# EAGLE design boards (EAGLE 9.4.2)

## Sheet 1 of 2
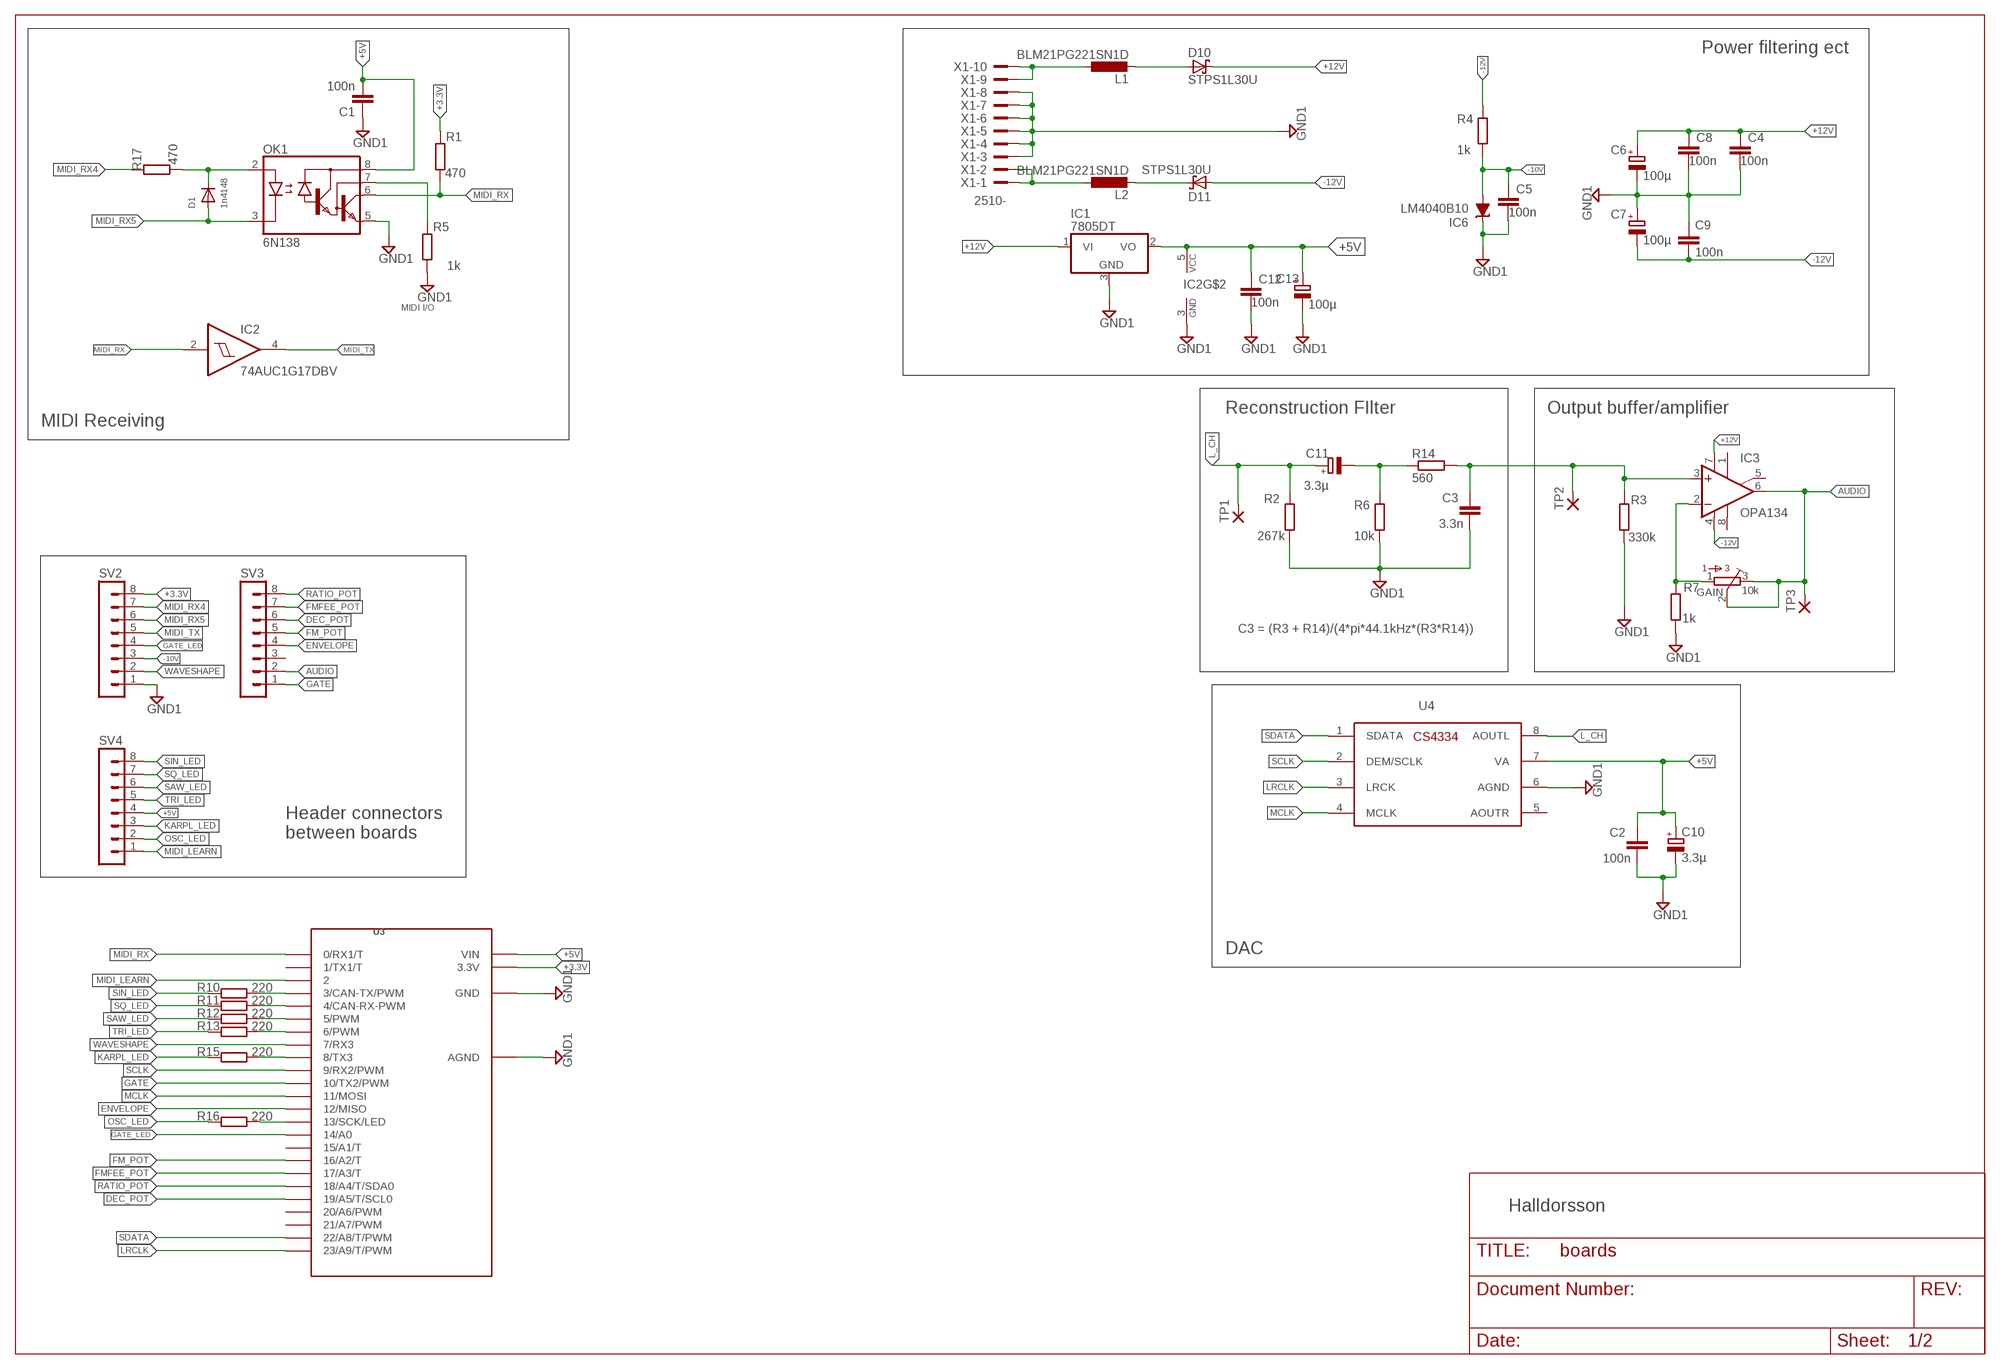
[diagram p0: schematic, sheet 1]

### Parts
C1  100n  C-EUC1206  [C1206]
C2  100n  C-EUC1206  [C1206]
C3  3.3n  C-EUC1206  [C1206]
C4  100n  C-EUC1206  [C1206]
C5  100n  C-EUC1206  [C1206]
C6  100µ  CPOL-EU153CLV-0505  [153CLV-0505]
C7  100µ  CPOL-EU153CLV-0505  [153CLV-0505]
C8  100n  C-EUC1206  [C1206]
C9  100n  C-EUC1206  [C1206]
C10  3.3µ  CPOL-EU153CLV-0405  [153CLV-0405]
C11  3.3µ  CPOL-EU153CLV-0405  [153CLV-0405]
C12  100n  C-EUC1206  [C1206]
C13  100µ  CPOL-EU153CLV-0505  [153CLV-0505]
D1  1n4148  DIODESOD-123  [SOD-123]
D10  STPS1L30U  MBRS130LT3  [SMB]
D11  STPS1L30U  MBRS130LT3  [SMB]
GAIN  10k  BOURNS_3362P_TRIMMERP  [BOURNS_3362P_TRIMMER]
IC1  7805DT  [TO252]
IC2  74AUC1G17DBV  [SOT23-5]
IC3  OPA134  TL071D  [SO08]
IC6  LM4040B10  LM4041B12DBZ  [DBZ_R-PDSO-G3]
L1  BLM21PG221SN1D  L-EUL2012C  [L2012C]
L2  BLM21PG221SN1D  L-EUL2012C  [L2012C]
OK1  6N138  [DIL08]
R1  470  R-EU_M1206  [M1206]
R2  267k  R-EU_M1206  [M1206]
R3  330k  R-EU_M1206  [M1206]
R4  1k  R-EU_M1206  [M1206]
R5  1k  R-EU_M1206  [M1206]
R6  10k  R-EU_M1206  [M1206]
R7  1k  R-EU_M1206  [M1206]
R10  220  R-EU_M1206  [M1206]
R11  220  R-EU_M1206  [M1206]
R12  220  R-EU_M1206  [M1206]
R13  220  R-EU_M1206  [M1206]
R14  560  R-EU_M1206  [M1206]
R15  220  R-EU_M1206  [M1206]
R16  220  R-EU_M1206  [M1206]
R17  470  R-EU_M1206  [M1206]
SV2  MA08-1  [MA08-1]
SV3  MA08-1  [MA08-1]
SV4  MA08-1  [MA08-1]
TP1  2,54/1,0  [2,54/1,0]
TP2  2,54/1,0  [2,54/1,0]
TP3  2,54/1,0  [2,54/1,0]
U3  TEENSY3.2.BAREBONES  [TEENSY3.2_BAREBONES]
U4  CS4334  [SOIC127P600X175-8N]
X1  2510-  [PAK100/2500-10]

### Nets
+3.3V: R1.2 SV2.8 U3.3.3V
+5V: C1.2 C2.1 C10.+ C12.1 C13.+ IC1.2(VO) IC2.5(VCC) OK1.8(VCC) SV4.4 U3.VIN U4.7(VA)
+12V: C4.1 C6.+ C8.1 D10.C IC1.1(VI) IC3.7(V+)
-10V: C5.1 IC6.2(A) R4.2 SV2.3
-12V: C7.- C9.2 D11.A IC3.4(V-) R4.1
AUDIO: GAIN.2 GAIN.3 IC3.6(OUT) SV3.2 TP3.1(P)
DEC_POT: SV3.6 U3.19/A5(19/A5/T/SCL0)
ENVELOPE: SV3.4 U3.12(12/MISO)
FM_POT: SV3.5 U3.16/A2(16/A2/T)
FMFEE_POT: SV3.7 U3.17/A3(17/A3/T)
GATE: SV3.1 U3.10(10/TX2/PWM)
GATE_LED: SV2.4 U3.14/A0
GND1: C1.1 C2.2 C3.2 C4.2 C5.2 C6.- C7.+ C8.2 C9.1 C10.- C12.2 C13.- IC1.3(GND) IC2.3(GND) IC6.1(C) OK1.5(GND) R2.2 R3.2 R5.1 R6.2 R7.2 SV2.1 U3.AGND U3.GND U4.6(AGND) X1.3 X1.4 X1.5 X1.6 X1.7 X1.8
KARPL_LED: R15.2 SV4.3
L_CH: C11.+ R2.1 TP1.1(P) U4.8(AOUTL)
LRCLK: U3.23/A9(23/A9/T/PWM) U4.3(LRCK)
MCLK: U3.11(11/MOSI) U4.4(MCLK)
MIDI_LEARN: SV4.1 U3.2
MIDI_RX: IC2.2(I) OK1.6(VO) R1.1 U3.0(0/RX1/T)
MIDI_RX4: R17.2 SV2.7
MIDI_RX5: D1.A OK1.3(C) SV2.6
MIDI_TX: IC2.4(O) SV2.5
N$1: C11.- R6.1 R14.1
N$4: D1.C OK1.2(A) R17.1
N$5: OK1.7(VB) R5.2
N$8: GAIN.1 IC3.2(-IN) R7.1
N$10: R16.1 U3.13(13/SCK/LED)
N$11: C3.1 IC3.3(+IN) R3.1 R14.2 TP2.1(P)
N$12: R10.1 U3.3(3/CAN-TX/PWM)
N$14: R11.1 U3.4(4/CAN-RX-PWM)
N$15: R12.1 U3.5(5/PWM)
N$19: R13.1 U3.6(6/PWM)
N$22: R15.1 U3.8(8/TX3)
N$46: L1.1 X1.9 X1.10
N$47: L2.1 X1.1 X1.2
N$49: D10.A L1.2
N$50: D11.C L2.2
OSC_LED: R16.2 SV4.2
RATIO_POT: SV3.8 U3.18/A4(18/A4/T/SDA0)
SAW_LED: R12.2 SV4.6
SCLK: U3.9(9/RX2/PWM) U4.2(DEM/SCLK)
SDATA: U3.22/A8(22/A8/T/PWM) U4.1(SDATA)
SIN_LED: R10.2 SV4.8
SQ_LED: R11.2 SV4.7
TRI_LED: R13.2 SV4.5
WAVESHAPE: SV2.2 U3.7(7/RX3)
Unconnected: IC3.1(ON1) IC3.5(ON2) IC3.8(OPT) SV3.3 U3.1(1/TX1/T) U3.15/A1(15/A1/T) U3.20/A6(20/A6/PWM) U3.21/A7(21/A7/PWM) U4.5(AOUTR)

### Notes on the sheet
- Power filtering ect
- MIDI I/O
- Reconstruction FIlter | Output buffer/amplifier
- MIDI Receiving
- C3 = (R3 + R14)/(4*pi*44.1kHz*(R3*R14))
- Header connectors 
  between boards
- DAC
- Halldorsson

## Sheet 2 of 2
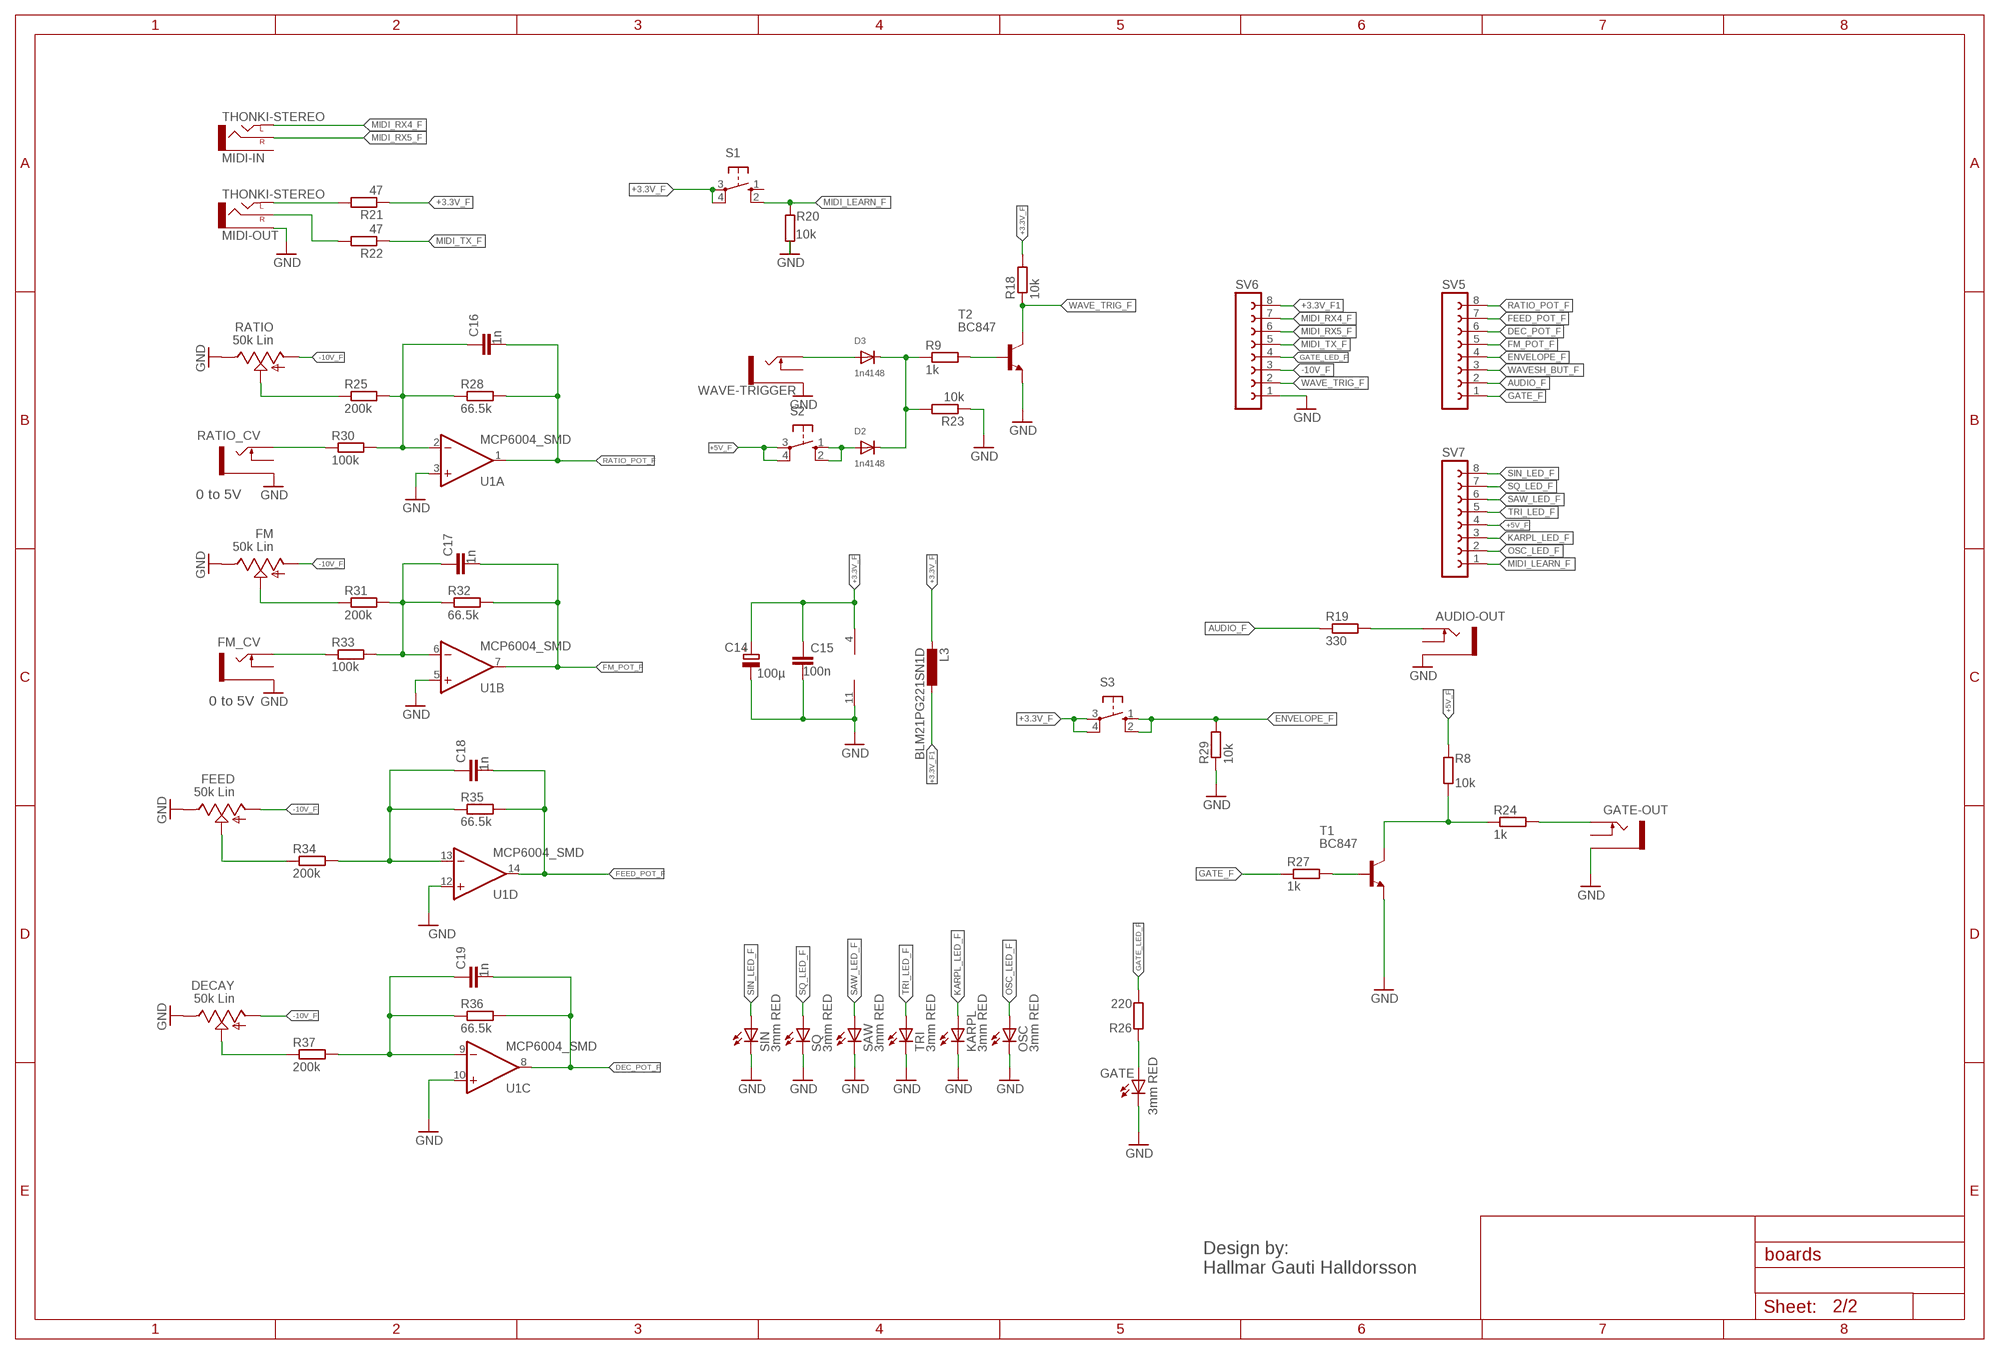
[diagram p1: schematic, sheet 2]

### Parts
AUDIO-OUT  THONKICONNNEW  [WQP-PJ301M-12_JACK]
C14  100µ  CPOL-EU153CLV-0505  [153CLV-0505]
C15  100n  C-EUC1206  [C1206]
C16  1n  C-EUC1206  [C1206]
C17  1n  C-EUC1206  [C1206]
C18  1n  C-EUC1206  [C1206]
C19  1n  C-EUC1206  [C1206]
D2  1n4148  DIODESOD-123  [SOD-123]
D3  1n4148  DIODESOD-123  [SOD-123]
DECAY  50k Lin  9MM_SNAP-IN_POT_  [9MM_SNAP-IN_POT]
FEED  50k Lin  9MM_SNAP-IN_POT_  [9MM_SNAP-IN_POT]
FM  50k Lin  9MM_SNAP-IN_POT_  [9MM_SNAP-IN_POT]
FM_CV  THONKICONNNEW  [WQP-PJ301M-12_JACK]
GATE  3mm RED  LED3MM  [LED3MM]
GATE-OUT  THONKICONNNEW  [WQP-PJ301M-12_JACK]
KARPL  3mm RED  LED3MM  [LED3MM]
L3  BLM21PG221SN1D  L-EUL2012C  [L2012C]
MIDI-IN  THONKI-STEREO  [WQP-PJ366ST_JACK]
MIDI-OUT  THONKI-STEREO  [WQP-PJ366ST_JACK]
OSC  3mm RED  LED3MM  [LED3MM]
R8  10k  R-EU_M1206  [M1206]
R9  1k  R-EU_M1206  [M1206]
R18  10k  R-EU_M1206  [M1206]
R19  330  R-EU_M1206  [M1206]
R20  10k  R-EU_M1206  [M1206]
R21  47  R-EU_M1206  [M1206]
R22  47  R-EU_M1206  [M1206]
R23  10k  R-EU_M1206  [M1206]
R24  1k  R-EU_M1206  [M1206]
R25  200k  R-EU_M1206  [M1206]
R26  220  R-EU_M1206  [M1206]
R27  1k  R-EU_M1206  [M1206]
R28  66.5k  R-EU_M1206  [M1206]
R29  10k  R-EU_M1206  [M1206]
R30  100k  R-EU_M1206  [M1206]
R31  200k  R-EU_M1206  [M1206]
R32  66.5k  R-EU_M1206  [M1206]
R33  100k  R-EU_M1206  [M1206]
R34  200k  R-EU_M1206  [M1206]
R35  66.5k  R-EU_M1206  [M1206]
R36  66.5k  R-EU_M1206  [M1206]
R37  200k  R-EU_M1206  [M1206]
RATIO  50k Lin  9MM_SNAP-IN_POT_  [9MM_SNAP-IN_POT]
RATIO_CV  THONKICONNNEW  [WQP-PJ301M-12_JACK]
S1  10-XX  [B3F-10XX]
S2  10-XX  [B3F-10XX]
S3  10-XX  [B3F-10XX]
SAW  3mm RED  LED3MM  [LED3MM]
SIN  3mm RED  LED3MM  [LED3MM]
SQ  3mm RED  LED3MM  [LED3MM]
SV5  FE08-1  [FE08]
SV6  FE08-1  [FE08]
SV7  FE08-1  [FE08]
T1  BC847  [SOT23]
T2  BC847  [SOT23]
TRI  3mm RED  LED3MM  [LED3MM]
U1  MCP6004_SMD  [SO14]
WAVE-TRIGGER  THONKICONNNEW  [WQP-PJ301M-12_JACK]

### Nets
+3.3V_F: C14.+ C15.1 L3.2 R18.2 R21.1 S1.3(P) S1.4(P1) S3.3(P) S3.4(P1) U1.4(P:V+)
+3.3V_F1: L3.1 SV6.8
+5V_F: R8.1 S2.3(P) S2.4(P1) SV7.4
-10V_F: DECAY.1(A) FEED.1(A) FM.1(A) RATIO.1(A) SV6.3
AUDIO_F: R19.1 SV5.2
B: R27.2 T1.1(B)
DEC_POT_F: C19.2 R36.2 SV5.6 U1.8(C:OUT)
ENVELOPE_F: R29.2 S3.1(S) S3.2(S1) SV5.4
FEED_POT_F: C18.2 R35.2 SV5.7 U1.14(D:OUT)
FM_POT_F: C17.2 R32.2 SV5.5 U1.7(B:OUT)
GATE_F: R27.1 SV5.1
GATE_LED_F: R26.2 SV6.4
GND: AUDIO-OUT.P$3_SLEEVE(SLEEVE) C14.- C15.2 DECAY.3(E) FEED.3(E) FM.3(E) FM_CV.P$3_SLEEVE(SLEEVE) GATE-OUT.P$3_SLEEVE(SLEEVE) GATE.K(C) KARPL.K(C) MIDI-OUT.P$3_SLEEVE(SLEEVE) OSC.K(C) R20.2 R23.1 R29.1 RATIO.3(E) RATIO_CV.P$3_SLEEVE(SLEEVE) SAW.K(C) SIN.K(C) SQ.K(C) SV6.1 T1.2(E) T2.2(E) TRI.K(C) U1.3(A:+IN) U1.5(B:+IN) U1.10(C:+IN) U1.11(P:V-) U1.12(D:+IN) WAVE-TRIGGER.P$3_SLEEVE(SLEEVE)
KARPL_LED_F: KARPL.A SV7.3
MIDI_LEARN_F: R20.1 S1.2(S1) SV7.1
MIDI_RX4_F: MIDI-IN.P$1_TIP(LEFT) SV6.7
MIDI_RX5_F: MIDI-IN.P$2_SWITCH(RIGHT) SV6.6
MIDI_TX_F: R22.1 SV6.5
N$2: AUDIO-OUT.P$1_TIP(TIP) R19.2
N$3: GATE.A R26.1
N$6: MIDI-OUT.P$2_SWITCH(RIGHT) R22.2
N$7: MIDI-OUT.P$1_TIP(LEFT) R21.2
N$9: R8.2 R24.1 T1.3(C)
N$13: R9.2 T2.1(B)
N$16: D2.A S2.1(S) S2.2(S1)
N$17: D3.A WAVE-TRIGGER.P$1_TIP(TIP)
N$18: D2.C D3.C R9.1 R23.2
N$20: GATE-OUT.P$1_TIP(TIP) R24.2
N$21: R25.1 RATIO.2(S)
N$23: C16.1 R25.2 R28.1 R30.2 U1.2(A:-IN)
N$24: R30.1 RATIO_CV.P$1_TIP(TIP)
N$25: FM.2(S) R31.1
N$26: C17.1 R31.2 R32.1 R33.2 U1.6(B:-IN)
N$27: FM_CV.P$1_TIP(TIP) R33.1
N$28: FEED.2(S) R34.1
N$29: DECAY.2(S) R37.1
N$30: C19.1 R36.1 R37.2 U1.9(C:-IN)
N$31: C18.1 R34.2 R35.1 U1.13(D:-IN)
OSC_LED_F: OSC.A SV7.2
RATIO_POT_F: C16.2 R28.2 SV5.8 U1.1(A:OUT)
SAW_LED_F: SAW.A SV7.6
SIN_LED_F: SIN.A SV7.8
SQ_LED_F: SQ.A SV7.7
TRI_LED_F: SV7.5 TRI.A
WAVE_TRIG_F: R18.1 SV6.2 T2.3(C)
WAVESH_BUT_F: SV5.3
Unconnected: AUDIO-OUT.P$2_SWITCH(SWITCH) FM_CV.P$2_SWITCH(SWITCH) GATE-OUT.P$2_SWITCH(SWITCH) MIDI-IN.P$3_SLEEVE(SLEEVE) RATIO_CV.P$2_SWITCH(SWITCH) S1.1(S) WAVE-TRIGGER.P$2_SWITCH(SWITCH)

### Notes on the sheet
- 0 to 5V
- 0 to 5V
- Design by: 
  Hallmar Gauti Halldorsson

## Library data of the parts
AUDIO-OUT FM_CV GATE-OUT RATIO_CV WAVE-TRIGGER = MusicThingModular:THONKICONN: 3.5mm socket for Eurorack modular synths
C1-C5 C8 C9 C12 C15-C19 = resistor:C-EU: CAPACITOR, European symbol
C6 C7 C10 C11 C13 C14 = resistor:CPOL-EU: POLARIZED CAPACITOR, European symbol
D1-D3 = adafruit:DIODE: Diode SMADIODE - SMA Surface Mount Package 20V 1A Schottky Diode Digikey: 641-1014-6-ND DO-1N4148 - Through Hole Small Current Diode SOD-123 20V 1 A (.5mV Vf) Schottky Diode - Digikey: MBRX120TPMSCT-ND SOD-323 10V 570mA (.38mV Vf, 3ns) Schottky Diode - Digikey: ZLLS410CT-ND SOD-523 30V 30mA Schottky Diode (RB751S-40TE61) - Digikey: RB751S-40TE61CT-ND SOT23-R/W - SOT23 Package (R = Solder Paste/Reflow Ovens, W = Hand-Soldering) BAT54Film 40V 300mA - Digikey: 497-7162-1-ND
D10 D11 = diode:MBRS130LT3: Schottky Power Rectifier Source: http://www.onsemi.com/pub/Collateral/MBRS130LT3-D.PDF
DECAY FEED FM RATIO = MusicThingModular:9MM_SNAP-IN_POT: 9mm vertical snap-in pot, Alpha / Panasonic style
GAIN = MusicThingModular:BOURNS_3362P_TRIMMER: 3362 Series 1/4" Square Trimmer
GATE KARPL OSC SAW SIN SQ TRI = led:LED: LED OSRAM: - CHIPLED LG R971, LG N971, LY N971, LG Q971, LY Q971, LO R971, LY R971 LH N974, LH R974 LS Q976, LO Q976, LY Q976 LO Q996 - Hyper CHIPLED LW Q18S LB Q993, LB Q99A, LB R99A - SideLED LS A670, LO A670, LY A670, LG A670, LP A670 LB A673, LV A673, LT A673, LW A673 LH A674 LY A675 LS A676, LA A676, LO A676, LY A676, LW A676 LS A679, LY A679, LG A679 - Hyper Micro SIDELED® LS Y876, LA Y876, LO Y876, LY Y876 LT Y87S - SmartLED LW L88C, LW L88S LB L89C, LB L89S, LG L890 LS L89K, LO L89K, LY L89K LS L896, LA L896, LO L896, LY L896 - TOPLED LS T670, LO T670, LY T670, LG T670, LP T670 LSG T670, LSP T670, LSY T670, LOP T670, LYG T670 LG T671, LOG T671, LSG T671 LB T673, LV T673, LT T673, LW T673 LH T674 LS T676, LA T676, LO T676, LY T676, LB T676, LH T676, LSB T676, LW T676 LB T67C, LV T67C, LT T67C, LS T67K, LO T67K, LY T67K, LW E67C LS E67B, LA E67B, LO E67B, LY E67B, LB E67C, LV E67C, LT E67C LW T67C LS T679, LY T679, LG T679 LS T770, LO T770, LY T770, LG T770, LP T770 LB T773, LV T773, LT T773, LW T773 LH T774 LS E675, LA E675, LY E675, LS T675 LS T776, LA T776, LO T776, LY T776, LB T776 LHGB T686 LT T68C, LB T68C - Hyper Mini TOPLED® LB M676 - Mini TOPLED Santana® LG M470 LS M47K, LO M47K, LY M47K Source: http://www.osram.convergy.de LUXEON: - LUMILED® LXK2-PW12-R00, LXK2-PW12-S00, LXK2-PW14-U00, LXK2-PW14-V00 LXK2-PM12-R00, LXK2-PM12-S00, LXK2-PM14-U00 LXK2-PE12-Q00, LXK2-PE12-R00, LXK2-PE12-S00, LXK2-PE14-T00, LXK2-PE14-U00 LXK2-PB12-K00, LXK2-PB12-L00, LXK2-PB12-M00, LXK2-PB14-N00, LXK2-PB14-P00, LXK2-PB14-Q00 LXK2-PR12-L00, LXK2-PR12-M00, LXK2-PR14-Q00, LXK2-PR14-R00 LXK2-PD12-Q00, LXK2-PD12-R00, LXK2-PD12-S00 LXK2-PH12-R00, LXK2-PH12-S00 LXK2-PL12-P00, LXK2-PL12-Q00, LXK2-PL12-R00 Source: www.luxeon.com KINGBRIGHT: KA-3528ASYC Source: www.kingbright.com
IC1 = linear:78*: Positive VOLTAGE REGULATOR Source: http://cache.national.com/ds/LM/LM78L05.pdf http://www.fairchildsemi.com/ds/LM/LM7805.pdf
IC2 = 74xx-little-us:74*1G17: Single Schmitt-Trigger Buffer
IC3 = linear:TL071: OP AMP
IC6 = texas:LM4041: PRECISION MICROPOWER SHUNT VOLTAGE REFERENCE Source: http://focus.ti.com/lit/ds/slcs146e/slcs146e.pdf; MPN: LM4041B12IDBZR; OC_FARNELL: 1575212; OC_NEWARK: 58K5882
L1-L3 = resistor:L-EU: INDUCTOR, European symbol
MIDI-IN MIDI-OUT = MusicThingModular:THONKI-STEREO: 3.5mm socket for Eurorack modular synths
OK1 = optocoupler:6N138: MOTOROLA OPTO COUPLER; MF: VISHAY/TELEFUNKEN; MPN: 6N138; OC_FARNELL: 9860150; OC_NEWARK: 35K5294
R1-R37 = resistor:R-EU_: RESISTOR, European symbol
S1-S3 = switch-omron:10-XX: OMRON SWITCH; MPN: B3F-1000; OC_FARNELL: 176432; OC_NEWARK: 36M3542
SV2-SV4 = con-lstb:MA08-1: PIN HEADER; OC_FARNELL: unknown; OC_NEWARK: unknown
SV5-SV7 = con-lsta:FE08-1: FEMALE HEADER; OC_FARNELL: unknown; OC_NEWARK: unknown
T1 T2 = transistor:BC847: NPN TRANSISTOR
TP1-TP3 = wirepad:2,54/1,0: THROUGH-HOLE PAD
U1 = MusicThingModular:MCP6004: Generic Quad Op Amp
U3 = hallmar-lib:TEENSY3.2.BAREBONES
U4 = SOIC127P600X175-8N:CS4334
X1 = con-3m:2510-: 3M (TM) Pak 100 4-Wall Header Source: 3M; MF: 3M; MPN: 2510-6002UB; OC_FARNELL: 9838244; OC_NEWARK: 46F4725

## Board
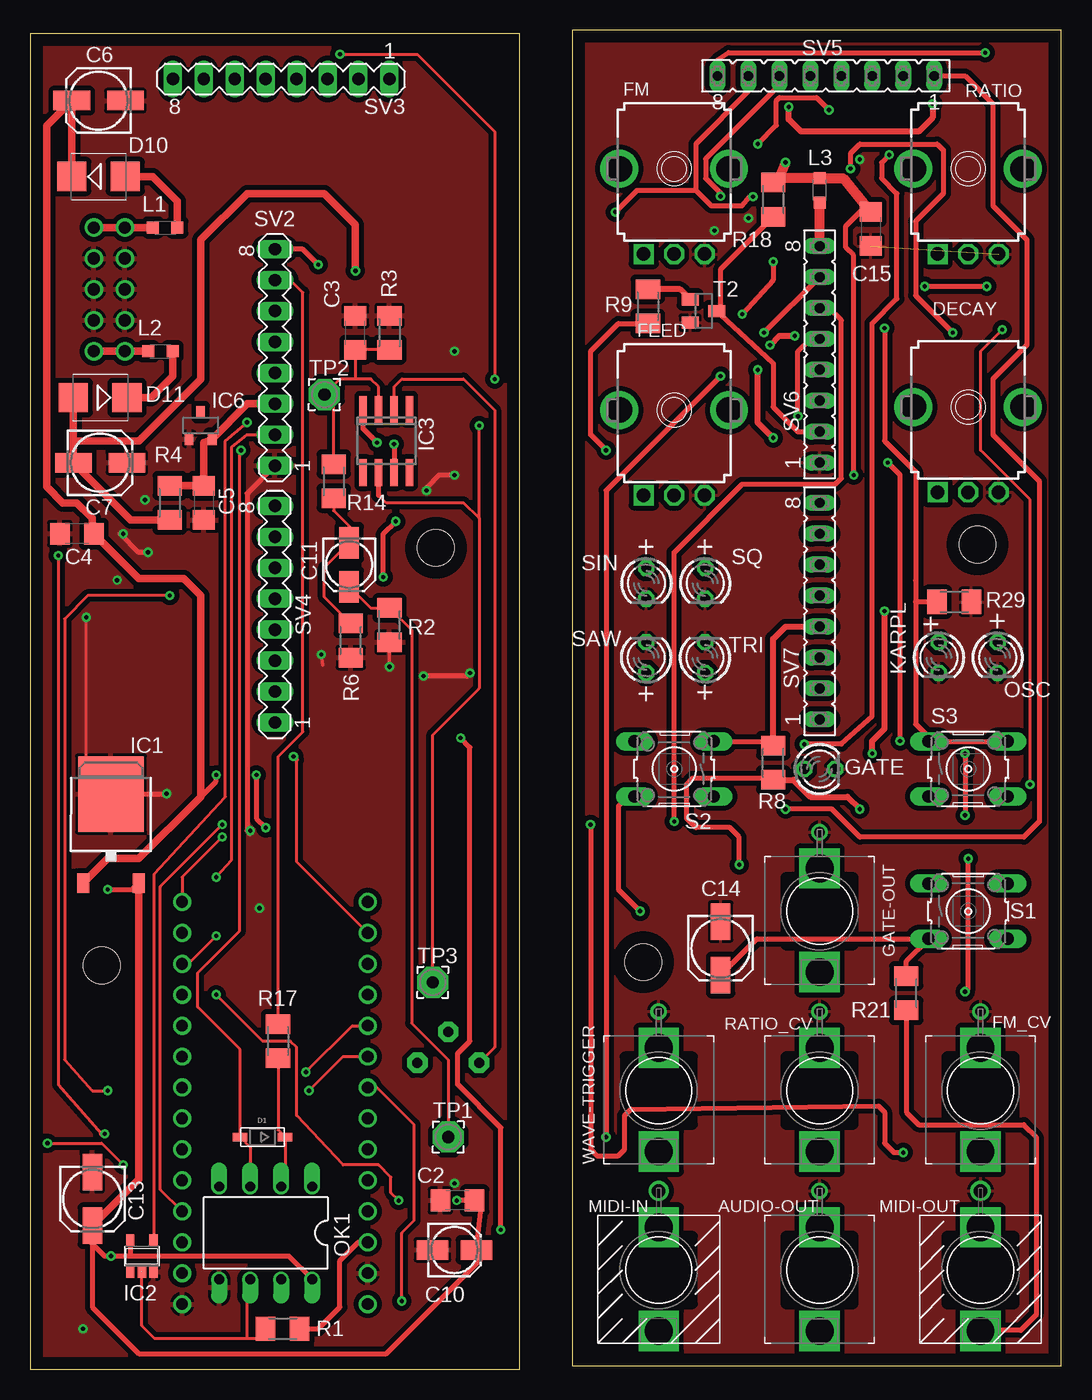
[diagram p2: board, top side]
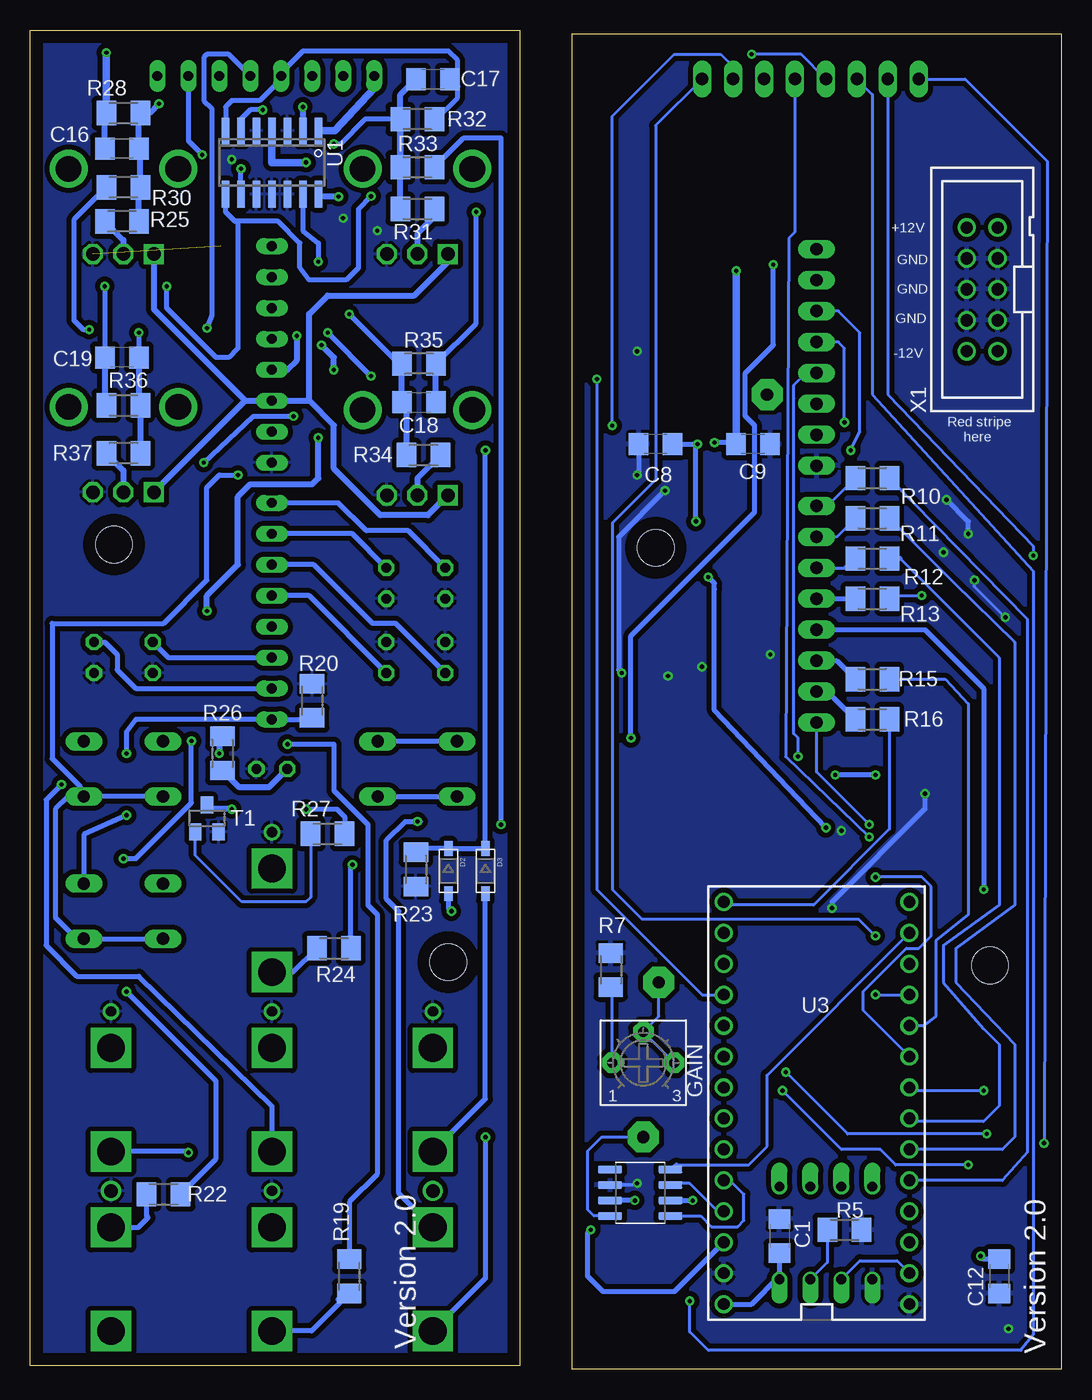
[diagram p3: board, bottom side, seen from below]

Size 84.59 x 109.91 mm. Coordinates in mm from the lower left corner, seen from the top.
Outline: 0,109.65 0,0 40.14,0 40.14,109.65 0,109.65
Outline: 44.45,109.91 44.45,0.25 84.59,0.25 84.59,109.91 44.45,109.91
Copper layers (1*16): Top 0.035mm / dielectric 1.5mm / Bottom 0.035mm
Design rules "default": minimum track width 6mil, minimum drill 0.35mm, track to track 6mil, track to pad 6mil, pad to pad 6mil, via to via 6mil, smd to smd 6mil, copper to edge 40mil, drill to drill 6mil, minimum pad ring 10mil, minimum via ring 8mil, stop-mask expansion 4mil, vias tented up to drill 0mil, thermal gap 10mil
Holes 3 mm at 5.84,33.15 33.27,67.44 50.29,33.4 77.72,67.69

### Footprints (pad centres in the part's own frame; a part is rotated, then mirrored left to right if it is on the bottom)
WQP-PJ301M-12_JACK = drill 2.286 pad 2.413 square: P$1_TIP 0,5; P$2_SWITCH 0,-3.5 | drill 0.85: P$3_SLEEVE 0,-6.5
C1206 = smd 1.6 x 1.8: 1 -1.4,0; 2 1.4,0
153CLV-0505 = smd 3 x 1.6: + 2.2,0; - -2.2,0
153CLV-0405 = smd 2.6 x 1.6: + 1.8,0; - -1.8,0
SOD-123 = smd 1.2 x 0.7: A 1.85,0; C -1.85,0
SMB = smd 2.4 x 2.4: A 2.2,0; C -2.2,0
9MM_SNAP-IN_POT = drill 1.1 square: 1 -2.5,-7 | drill 1.1 octagon: 2 0,-7; 3 2.5,-7 | drill 2.1 pad 2.794: CHASSIS1 -4.5,0; CHASSIS2 4.5,0
BOURNS_3362P_TRIMMER = drill 0.813 pad 1.676 octagon: 1 -2.54,0; 2 0,2.54; 3 2.54,0
LED3MM = drill 0.813 octagon: A -1.27,0; K 1.27,0
TO252 = smd 1 x 1.6: 1 -2.28,-4.8; 2 2.28,-4.8 | smd 5.4 x 6.2: 3 0,2.5
SOT23-5 = smd 0.69 x 0.99: 1 -0.95,-1.29; 2 0,-1.29; 3 0.95,-1.29; 4 0.95,1.3; 5 -0.95,1.3
SO08 = smd 0.6 x 2.2: 1 -1.905,-2.6; 2 -0.635,-2.6; 3 0.635,-2.6; 4 1.905,-2.6; 5 1.905,2.6; 6 0.635,2.6; 7 -0.635,2.6; 8 -1.905,2.6
DBZ_R-PDSO-G3 = smd 0.7 x 1: 1 -0.95,-1.1; 2 0.95,-1.1; 3 0,1.1
L2012C = smd 1 x 1: 1 -1,0; 2 1,0
WQP-PJ366ST_JACK = drill 2.286 pad 2.794 square: P$1_TIP 0,5; P$2_SWITCH 0,-3.5 | drill 1.1: P$3_SLEEVE 0,-6.5
DIL08 = drill 0.813 offset: 1 -3.81,-3.81; 2 -1.27,-3.81; 3 1.27,-3.81; 4 3.81,-3.81; 5 3.81,3.81; 6 1.27,3.81; 7 -1.27,3.81; 8 -3.81,3.81
M1206 = smd 1.6 x 2: 1 -1.4,0; 2 1.4,0
B3F-10XX = drill 1.016 long: 1 -3.251,2.261; 2 3.251,2.261; 3 -3.251,-2.261; 4 3.251,-2.261
MA08-1 = drill 1.016 long: 1 -8.89,0; 2 -6.35,0; 3 -3.81,0; 4 -1.27,0; 5 1.27,0; 6 3.81,0; 7 6.35,0; 8 8.89,0
FE08 = drill 0.813 long: 1 -8.89,0; 2 -6.35,0; 3 -3.81,0; 4 -1.27,0; 5 1.27,0; 6 3.81,0; 7 6.35,0; 8 8.89,0
SOT23 = smd 1 x 1.4: 1 -0.95,-1.1; 2 0.95,-1.1; 3 0,1.1
2,54/1,0 = drill 1.016 pad 2.54 octagon: 1 0,0
SO14 = smd 0.6 x 2.2: 1 -3.81,-2.6; 2 -2.54,-2.6; 3 -1.27,-2.6; 4 0,-2.6; 5 1.27,-2.6; 6 2.54,-2.6; 7 3.81,-2.6; 8 3.81,2.6; 9 2.54,2.6; 10 1.27,2.6; 11 0,2.6; 12 -1.27,2.6; 13 -2.54,2.6; 14 -3.81,2.6
TEENSY3.2_BAREBONES = drill 0.965: 0 -7.62,12.7; 1 -7.62,10.16; 2 -7.62,7.62; 3 -7.62,5.08; 3.3V 7.62,10.16; 4 -7.62,2.54; 5 -7.62,0; 6 -7.62,-2.54; 7 -7.62,-5.08; 8 -7.62,-7.62; 9 -7.62,-10.16; 10 -7.62,-12.7; 11 -7.62,-15.24; 12 -7.62,-17.78; 13 7.62,-17.78; 14/A0 7.62,-15.24; 15/A1 7.62,-12.7; 16/A2 7.62,-10.16; 17/A3 7.62,-7.62; 18/A4 7.62,-5.08; 19/A5 7.62,-2.54; 20/A6 7.62,0; 21/A7 7.62,2.54; 22/A8 7.62,5.08; 23/A9 7.62,7.62; AGND 7.62,12.7; GND -7.62,15.24; VIN 7.62,15.24
SOIC127P600X175-8N = smd 1.97 x 0.6: 1 -2.475,1.905; 2 -2.475,0.635; 3 -2.475,-0.635; 4 -2.475,-1.905; 5 2.475,-1.905; 6 2.475,-0.635; 7 2.475,0.635; 8 2.475,1.905
PAK100/2500-10 = drill 1 pad 1.422: 1 -5.08,-1.27; 2 -5.08,1.27; 3 -2.54,-1.27; 4 -2.54,1.27; 5 0,-1.27; 6 0,1.27; 7 2.54,-1.27; 8 2.54,1.27; 9 5.08,-1.27; 10 5.08,1.27

### Placement (x,y rotation side)
AUDIO-OUT  64.77,8.13 180 top
C1  23.11,10.92 270 bottom
C2  35.05,13.84 180 top
C3  26.67,85.09 90 top
C4  3.81,68.58 180 top
C5  14.22,71.12 270 top
C6  5.59,104.14 180 top
C7  5.71,74.42 0 top
C8  33.27,75.95 180 bottom
C9  25.27,75.95 180 bottom
C10  34.8,9.78 0 top
C11  26.16,66.04 270 top
C12  5.08,7.62 270 bottom
C13  5.08,13.97 270 top
C14  56.64,34.54 270 top
C15  68.96,93.6 270 top
C16  77.09,100.2 180 bottom
C17  51.56,105.92 0 bottom
C18  52.7,79.38 0 bottom
C19  77.09,83.06 180 bottom
D1  19.05,19.05 180 top
D2  50.29,40.89 270 bottom
D3  47.24,40.89 270 bottom
D10  5.59,97.92 0 top
D11  5.71,79.76 180 top
DECAY  76.96,78.99 0 top
FEED  52.83,78.74 0 top
FM  52.83,98.55 0 top
FM_CV  77.98,22.86 180 top
GAIN  34.29,25.15 0 bottom
GATE  64.77,49.28 0 top
GATE-OUT  64.77,37.59 180 top
IC1  6.6,44.7 0 top
IC2  9.14,9.27 0 top
IC3  29.21,76.2 180 top
IC6  13.97,77.47 0 top
KARPL  74.55,58.42 270 top
L1  11.05,93.73 0 top
L2  10.67,83.57 0 top
L3  64.77,96.77 90 top
MIDI-IN  51.56,8.13 180 top
MIDI-OUT  77.98,8.13 180 top
OK1  19.3,11.18 180 top
OSC  79.38,58.42 270 top
R1  20.7,3.3 0 top
R2  29.46,61.09 270 top
R3  29.46,85.09 90 top
R4  11.43,71.12 90 top
R5  17.78,11.43 180 bottom
R6  26.29,59.82 270 top
R7  36.96,32.77 90 bottom
R8  60.96,49.78 270 top
R9  50.67,87.25 90 top
R10  15.49,73.15 180 bottom
R11  15.49,69.85 180 bottom
R12  15.49,66.55 180 bottom
R13  15.49,63.25 180 bottom
R14  24.89,72.9 90 top
R15  15.49,56.64 180 bottom
R16  15.49,53.34 180 bottom
R17  20.32,26.92 90 top
R18  60.96,96.01 90 top
R19  58.42,7.62 270 bottom
R20  61.47,54.86 90 bottom
R21  71.88,30.86 270 top
R22  73.66,14.35 180 bottom
R23  52.96,41.02 90 bottom
R24  59.69,34.54 180 bottom
R25  77.09,94.23 0 bottom
R26  68.83,50.55 90 bottom
R27  60.2,43.94 180 bottom
R28  76.96,103.12 180 bottom
R29  75.82,62.99 180 top
R30  76.96,97.03 0 bottom
R31  52.83,95.25 180 bottom
R32  52.83,102.62 0 bottom
R33  52.83,98.68 180 bottom
R34  52.32,75.06 180 bottom
R35  52.7,82.55 0 bottom
R36  76.96,79.12 180 bottom
R37  76.96,75.18 0 bottom
RATIO  76.96,98.55 0 top
RATIO_CV  64.77,22.86 180 top
S1  76.96,37.59 0 top
S2  52.83,49.28 180 top
S3  76.96,49.28 0 top
SAW  50.55,58.42 90 top
SIN  50.55,64.52 270 top
SQ  55.37,64.52 270 top
SV2  20.07,83.06 90 top
SV3  20.57,105.92 180 top
SV4  20.07,61.98 90 top
SV5  65.28,106.17 180 top
SV6  64.77,83.31 90 top
SV7  64.77,62.23 90 top
T1  70.1,45.21 0 bottom
T2  55.24,86.87 270 top
TP1  34.29,19.05 0 top
TP2  24.13,80.01 0 top
TP3  33.02,31.75 0 top
TRI  55.37,58.42 90 top
U1  64.77,99.06 180 bottom
U3  20.07,20.57 180 bottom
U4  34.54,14.48 180 bottom
WAVE-TRIGGER  51.56,22.86 180 top
X1  6.48,88.65 90 bottom

### Tracks (layer width: path | path; a pad name or v marks a point on that pad's centre or on a via)
+3.3V  (via drill 0.35)
  Top 0.406: R1.2 23.62,3.3 25.4,5.08 25.4,8.89 26.92,10.41 U3.3.3V | v38.61,11.43 38.61,19.81 35.05,23.37 35.05,25.91 36.07,26.92 36.07,51.05 v35.31,51.82 | v23.62,90.68 22.35,91.95 SV2.8
  Bottom 0.406: U3.3.3V 31.75,6.35 37.59,6.35 38.86,7.62 38.86,11.18 v38.61,11.43 | v35.31,51.82 35.31,60.2 25.15,70.36 25.15,77.47 25.91,78.23 25.91,81.79 23.62,84.07 v23.62,90.68
+3.3V_F  (via drill 0.35)
  Top 0.406: v67.56,73.41 67.56,91.44 66.93,92.08 66.93,93.86 68.56,95.49 | R21.1 71.88,33.5 S1.3 59.63,35.33 C14.+
  Top 0.813: L3.2 66.69,97.77 68.56,95.49 C15.1 | L3.2 61.32,97.77 R18.2 | L3.2 61.47,97.79 v61.98,99.06
  Bottom 0.254: 80.01,47.02 79.76,47.02
  Bottom 0.406: v67.56,73.41 69.09,73.41 70.1,72.39 70.1,64.77 73.66,61.21 82.8,61.21 82.8,50.12 80.52,47.83 80.52,47.32 S3.4 | S1.3 S1.4 80.8,35.33 82.55,37.08 82.55,45.97 81.51,47.02 S3.4 | S3.3 79.76,47.02 | S3.4 80.01,47.02
  Bottom 0.61: v61.98,99.06 64.77,99.06 U1.4
+3.3V_F1
  Top 0.813: SV6.8 L3.1
+5V  (via drill 0.35)
  Top 0.406: OK1.8 21.21,9.27 8.19,9.27 | 8.19,9.27 v6.6,9.27 6.1,9.27 4.7,10.67 4.7,11.39 4.91,11.6 C13.+ 5.08,5.08 8.89,1.27 29.21,1.27 37,9.06 C10.+ 37,13.3 C2.1 v34.98,13.84 | IC2.5 8.19,9.27 | v6.35,39.37 8.35,39.37 IC1.2
  Top 0.61: IC1.2 8.88,15.57 4.91,11.6
  Bottom 0.406: C1.2 23.11,7.62 | 23.11,7.62 OK1.8 | U3.VIN 25.4,5.33 23.11,7.62 | v34.98,13.84 U4.7 | SV4.4 11.18,60.71 6.35,55.88 v6.35,39.37 | C12.1 6.35,9.02 v6.6,9.27
+5V_F
  Top 0.406: S2.3 60.61,51.54 R8.1
  Top 0.508: R8.1 60.96,59.94 61.98,60.96 SV7.4
  Bottom 0.406: S2.4 S2.3
+12V  (via drill 0.35)
  Top 0.406: v29.84,75.95 IC3.7 | 13.72,46.74 15.24,48.26 v15.24,48.77 | v18.54,48.77 18.54,45.21 v19.3,44.45 | v28.96,65.02 28.96,68.58 v29.97,69.6
  Top 0.61: D10.C C6.+ 1.32,102.07 1.32,72.44 2.64,71.12 3.81,71.12 5.08,69.85 5.08,68.58 C4.1 8.89,64.9 12.57,64.9 13.97,63.5 13.97,46.99 13.72,46.74 8.89,41.91 6.33,41.91 IC1.1
  Bottom 0.406: C8.1 v29.84,75.95 | v15.24,48.77 v18.54,48.77 | v19.3,44.45 28.45,54.1 28.45,64.01 28.45,64.52 v28.96,65.02 | v29.97,69.6 29.97,75.82
  Bottom 0.508: 29.97,75.82 v29.84,75.95
-10V
  Top 0.61: SV2.3 17.8,79.25 IC6.2 14.22,76.05 C5.1 R4.2
-10V_F
  Bottom 0.508: 65.28,79.5 SV6.3 | 65.68,79.5 SV6.3 | DECAY.1 66.95,79.5 | 66.95,79.5 SV6.3 | RATIO.1 74.46,87.01 66.95,79.5 | SV6.3 61.72,79.5 | FM.1 50.33,90.89 53.09,88.14 60.2,88.14 61.72,86.61 61.72,79.5 | FEED.1 51.97,70.1 55.88,70.1 59.69,73.91 59.69,77.47 61.72,79.5
-12V  (via drill 0.35)
  Top 0.406: v28.45,76.07 27.3,77.22 IC3.4
  Top 0.61: D11.A 3.52,76.2 | 3.52,76.2 C7.- 8.22,69.72 R4.1 | 3.52,76.2 8.89,76.2 13.97,81.28 13.97,92.71 17.78,96.52 24.13,96.52 26.67,93.98 v26.67,90.17
  Bottom 0.406: C9.2 26.8,76.07 v28.45,76.07
  Bottom 0.61: v26.67,90.17 C9.2
AUDIO  (via drill 0.35)
  Top 0.254: TP3.1 33.02,52.07 36.83,55.88 36.83,69.85 | 36.83,69.85 35.56,71.12 29.21,71.12 28.57,71.75 | 36.83,69.85 v36.83,77.47
  Top 0.406: 28.57,71.75 IC3.6
  Bottom 0.254: v36.83,77.47 36.83,102.87 31.75,107.95 27.94,107.95 26.67,106.68 | GAIN.3 GAIN.2 33.02,28.96 TP3.1
  Bottom 0.406: 26.67,106.68 26.67,105.41 26.92,105.66 SV3.2
AUDIO_F  (via drill 0.35)
  Top 0.406: v70.48,99.69 69.85,99.06 69.85,97.79 71.12,96.52 71.12,87.88 69.09,85.85 69.09,53.59 66.55,51.31 v63.5,51.31
  Bottom 0.305: R19.1 58.42,9.14
  Bottom 0.406: SV5.2 71.63,100.84 v70.48,99.69 | v63.5,51.31 59.69,51.31 59.69,47.5 56.9,44.7 56.9,38.1 56.13,37.34 56.13,16 58.42,13.72 58.42,9.14 58.42,8.89
B
  Bottom 0.254: R27.2 61.6,38.73 61.98,38.35 67.24,38.35 71.05,42.16 71.05,43.69
  Bottom 0.508: 71.05,43.69 T1.1
DEC_POT  (via drill 0.35)
  Top 0.254: v30.48,5.59 30.48,11.18 31.5,12.19 31.5,20.07 28.19,23.37 27.94,23.11 U3.19/A5
  Bottom 0.254: SV3.6 15.49,104.65 15.49,80.01 2.29,65.53 2.29,2.79 3.3,1.52 28.96,1.52 30.48,3.05 v30.48,5.59
DEC_POT_F  (via drill 0.35)
  Top 0.406: SV5.6 61.47,105.41 55.42,99.36 55.42,97.76 56.64,96.54 v56.64,96.29 | v73.41,88.9 v78.49,88.9
  Bottom 0.406: v56.64,96.29 57.68,95.25 57.68,90.4 58.67,89.41 61.72,89.41 62.48,90.42 62.48,92.46 64.26,94.23 67.56,94.23 | 67.56,94.23 67.82,94.23 68.58,95 U1.8 | 67.56,94.23 67.56,83.82 68.33,83.06 69.34,83.06 73.41,87.12 v73.41,88.9 | v78.49,88.9 C19.2
  Bottom 0.508: C19.2 78.49,79.25 R36.2
ENVELOPE  (via drill 0.35)
  Top 0.254: v15.75,43.69 12.45,40.39 U3.12
  Bottom 0.254: SV3.4 21.84,93.34 22.35,92.84 22.61,50.29 v15.75,43.69
  Bottom 0.406: 15.62,43.56 v15.75,43.69
ENVELOPE_F  (via drill 0.35)
  Top 0.406: v70.1,85.47 70.1,76.2 72.64,73.66 72.64,62.99 | 72.64,62.99 72.64,52.96 73.71,51.89 S3.1 S3.2 | R29.2 72.64,62.99 | 72.64,64.77 72.64,62.99
  Bottom 0.406: v70.1,85.47 69.72,86.49 69.72,103.5 70.36,104.14 70.36,107.7 70.1,107.95 68.33,107.95 SV5.4
FEED_POT_F  (via drill 0.35)
  Top 0.406: SV5.7 58.93,104.9 54.61,100.58 54.61,96.77 | 54.61,96.77 55.88,95.5 58.42,95.5 59.05,96.27 v59.31,96.27 | v48.01,95 49.78,96.77 54.61,96.77
  Bottom 0.406: R35.2 48.01,85.85 v48.01,95
  Bottom 0.508: v59.31,96.27 60.77,96.27 U1.14 | C18.2 R35.2
FM_POT  (via drill 0.35)
  Top 0.254: v25.4,107.95 31.75,107.95 38.1,101.6 v38.1,81.28
  Bottom 0.254: SV3.5 21.34,107.95 v25.4,107.95 | v38.1,81.28 38.1,39.37 33.02,34.29 30.48,31.75 29.46,30.73 U3.16/A2
FM_POT_F
  Bottom 0.406: 51.31,102.62 49.53,104.39 49.53,105.29 49.53,107.44 50.29,108.2 62.23,108.2 64.01,106.43 SV5.5 64.01,105.92 65.79,104.14 68.07,104.14 68.58,103.63 U1.7
  Bottom 0.508: R32.2 51.31,102.62 | 49.53,105.29 C17.2
FMFEE_POT  (via drill 0.35)
  Top 0.254: v2.29,66.8 2.29,23.37 5.84,19.3 | v22.61,24.38 26.42,28.19 U3.17/A3
  Top 0.406: 5.84,19.3 v6.1,19.3
  Bottom 0.254: SV3.7 14.22,80.01 2.29,67.56 v2.29,66.8 | v6.1,19.3 17.53,19.3 v22.61,24.38
GATE  (via drill 0.35)
  Top 0.254: v15.24,35.56 12.95,33.27 U3.10
  Bottom 0.254: SV3.1 33.27,102.11 33.27,73.03 36.83,69.47 36.83,39.37 34.42,36.96 16.64,36.96 v15.24,35.56
GATE_F  (via drill 0.35)
  Top 0.406: SV5.1 76.71,106.17 78.99,103.89 78.99,95.5 81.79,92.71 81.79,84.07 78.99,81.28 78.99,76.71 82.8,72.9 82.8,44.96 81.53,43.69 68.07,43.69 65.79,45.97 v61.98,45.97
  Bottom 0.406: v61.98,45.97 59.44,45.97 58.8,45.34 R27.1
GATE_LED  (via drill 0.35)
  Top 0.254: U3.14/A0 21.84,41.66 21.84,50.04
  Top 0.406: 21.84,50.04 v21.59,50.29
  Bottom 0.254: v21.59,50.29 21.59,51.82 21.95,52.17 21.95,79.71 21.94,79.72 21.94,80.77 20.93,81.79 SV2.4
GATE_LED_F  (via drill 0.35)
  Top 0.508: v69.09,50.55 69.09,51.56 70.1,52.58 v70.1,62.23 | v60.96,76.45 59.69,77.72 v59.69,82.04 | v60.71,84.07 61.47,84.84 v62.74,84.84
  Bottom 0.508: R26.2 69.09,51.69 v69.09,50.55 | v70.1,62.23 70.1,63.5 67.56,66.04 67.56,71.63 66.55,72.64 61.47,72.64 60.96,73.15 v60.96,76.45 | v59.69,82.04 59.69,83.06 v60.71,84.07 | v62.74,84.84 62.74,82.8 63.5,82.04 SV6.4
GND  (via drill 0.35)  (1 unrouted)
  other vias: 68.07,99.31 56.13,93.47 58.93,94.49
  pour Top (isolate 0.406): 44.7,109.47 84.84,109.47 84.58,0 44.45,0
  pour Bottom (isolate 0.406): 44.7,109.47 84.07,109.22 84.07,-0.76 44.2,-0.25
GND1  (via drill 0.35)
  Top 0.254: IC1.3 4.57,49.24 v4.57,61.72
  Top 0.305: R2.2 v29.46,57.66 | 24,57.78 v23.88,58.67
  Top 0.406: v9.65,67.06 8.89,67.06 7.37,68.58 v7.62,68.58 | SV2.1 17.78,71.88 17.78,44.2 18.03,43.94 v18.03,44.2 | IC1.3 11.14,47.2 v11.18,47.24 | v34.8,73.41 33.53,73.41 32.51,72.39 v32.51,72.14 | v36.07,57.15 35.81,56.9 v32.26,56.9
  Bottom 0.254: v4.57,61.72 7.11,64.26 v7.11,64.77
  Bottom 0.305: U4.6 34.92,15.11 v34.8,15.24
  Bottom 0.406: v7.62,68.58 7.62,69.6 v9.4,71.37 | v11.18,47.24 11.18,45.97 18.8,38.35 v18.8,37.85 | C8.2 34.67,73.53 v34.8,73.41 | v32.51,72.14 36.32,68.33 36.32,57.4 v36.07,57.15
  other vias: 4.32,3.3 34.8,83.57
  pour Top (isolate 0.406): -1.27,111.25 39.88,111.25 39.88,-1.52 -1.27,-1.52
  pour Bottom (isolate 0.406): -0.76,110.49 40.13,111.25 40.13,-1.02 -0.76,-0.76
KARPL_LED
  Bottom 0.406: SV4.3 18.42,58.17 R15.2
KARPL_LED_F
  Bottom 0.406: KARPL.A 73.28,58.42 SV7.3
L_CH
  Top 0.254: TP1.1 34.29,25.4 31.29,28.4 31.29,60.66 R2.1 27.91,62.49 C11.+
  Bottom 0.254: TP1.1 37.72,19.05 38.86,17.91 38.86,13.08 38.35,12.57 U4.8
LRCLK
  Bottom 0.254: U3.23/A9 28.19,12.95 30.48,15.24 31.94,15.24
  Bottom 0.406: 31.94,15.24 U4.3
MCLK
  Bottom 0.254: 31.56,16.76 25.65,16.76 24.13,18.29 24.13,24.13 U3.11
  Bottom 0.406: U4.4 31.56,16.76
MIDI_LEARN  (via drill 0.35)
  Top 0.254: U3.2 10.67,14.73 10.67,39.62 v15.75,44.7
  Bottom 0.254: v15.75,44.7 20.07,49.02 SV4.1
MIDI_LEARN_F  (via drill 0.35)
  Top 0.406: v76.71,50.55 v76.71,45.47
  Bottom 0.406: R20.1 61.59,53.34 SV7.1 75.95,53.34 76.71,52.32 v76.71,50.55 | v76.71,45.47 80.21,43.89 S1.2
MIDI_RX
  Top 0.254: 17.78,2.54 10.16,2.54 9.14,3.56 IC2.2 | 17.78,2.54 17.78,6.1 | 17.78,2.54 18.54,2.54 19.05,3.05
  Top 0.406: 17.78,6.1 17.78,7.11 OK1.6 | 19.05,3.05 R1.1
  Bottom 0.254: OK1.6 16.51,8.89 13.46,8.89 U3.0
  Bottom 0.406: OK1.6
MIDI_RX4
  Top 0.254: R17.2 20.32,50.29 22.35,52.32 22.35,88.39 21.34,89.41 SV2.7
MIDI_RX4_F  (via drill 0.35)
  Top 0.406: SV6.7 v60.2,85.09 | v56.64,81.53 47.24,72.14 v47.24,19.05
  Bottom 0.406: v60.2,85.09 v56.64,81.53 | v47.24,19.05 47.24,7.45 MIDI-IN.P$1_TIP
MIDI_RX5  (via drill 0.35)
  Top 0.254: OK1.3 18.03,18.22 D1.A 17.2,26.23 13.72,29.72 13.72,32.51 17.16,35.96 17.16,75.33 v17.27,75.44
  Bottom 0.254: v17.27,75.44 16.51,76.96 16.51,85.09 18.29,86.87 SV2.6
MIDI_RX5_F  (via drill 0.35)
  Top 0.406: v52.83,44.96 52.83,67.06 58.42,72.64 66.04,72.64 66.55,73.15 66.55,86.11 65.53,87.12 SV6.6
  Bottom 0.406: MIDI-IN.P$2_SWITCH 54.36,14.42 54.36,37.59 55.37,38.61 55.37,43.43 53.85,44.96 v52.83,44.96 52.58,44.96
MIDI_TX  (via drill 0.35)
  Top 0.254: 10.16,10.64 10.16,40.64 16,46.99 16,76.2 v17.78,77.72
  Top 0.406: IC2.4 10.16,10.64
  Bottom 0.254: v17.78,77.72 17.78,83.82 18.29,84.33 SV2.5
MIDI_TX_F  (via drill 0.35)
  Top 0.406: v76.71,30.99 76.96,31.24 v76.96,41.91 | v71.37,51.56 71.37,73.41 v70.36,74.42 | v62.99,78.23 62.99,83.57 64.01,84.58 SV6.5
  Bottom 0.406: R22.1 69.34,17.27 69.34,23.62 v76.71,30.99 | v76.96,41.91 75.95,41.91 71.37,46.48 v71.37,51.56 | v70.36,74.42 66.29,78.23 v62.99,78.23
N$1
  Top 0.254: R14.1 24.89,70.48 26.16,69.21 C11.- 24.13,65.81 24.13,63.38 R6.1
N$2
  Bottom 0.406: R19.2 61.51,3.13 AUDIO-OUT.P$1_TIP
  Bottom 0.508: 59.31,5.72 R19.2
N$3
  Bottom 0.508: GATE.A 65.02,47.75 67.44,47.75 R26.1
N$4
  Top 0.254: R17.1 20.32,19.63 D1.C 20.9,15.31
  Top 0.406: 20.9,15.31 OK1.2
N$5
  Bottom 0.254: R5.2 19.18,8.76 OK1.7
N$6
  Bottom 0.406: MIDI-OUT.P$2_SWITCH 75.75,11.63 74.93,12.45 75.06,12.58 R22.2
N$7
  Top 0.406: R21.2 71.88,21.08 72.9,20.07 81.53,20.07 82.55,19.05 82.55,4.45 81.28,3.17 78.03,3.17 MIDI-OUT.P$1_TIP
N$8
  Top 0.254: IC3.2 29.84,80.64 30.48,81.28 35.56,81.28 38.1,78.74 38.1,26.42 GAIN.1
  Bottom 0.254: GAIN.1 36.83,31.24 R7.1
N$9  (via drill 0.35)
  Top 0.406: v58.17,41.4 58.17,43.69 57.4,44.45 54.61,44.45 53.85,45.21 53.85,48.01 54.36,48.51 61.34,48.51 61.47,48.38
  Top 0.508: R8.2 61.47,48.38 62.61,48.38 64,46.99 67.06,46.99 v68.07,45.97
  Bottom 0.406: R24.1 58.29,41.28 v58.17,41.4
  Bottom 0.508: T1.3 69.77,45.97 v68.07,45.97
N$10
  Bottom 0.254: R16.1 14.09,44.33 20.32,38.1 27.94,38.1
  Bottom 0.406: 27.94,38.1 U3.13
N$11
  Top 0.254: R14.2 24.89,79.25 23.88,79.76 TP2.1 25.4,81.28 26.67,81.28 | IC3.3 28.57,80.64 27.94,81.28 26.67,81.28 | 26.67,81.28 C3.1 R3.1
N$12
  Bottom 0.254: R10.1 2.79,61.6 2.79,17.78 4.83,15.49 U3.3
N$13
  Top 0.508: T2.1 53.31,88.65 R9.2
N$14
  Bottom 0.254: R11.1 8.89,64.65 3.81,59.69 3.81,38.1 8.64,34.54 8.64,31.75 3.81,26.67 3.81,19.05 4.83,18.03 U3.4
N$15
  Bottom 0.254: 12.19,20.32 6.35,20.32 5.08,21.59 5.08,26.67 6.35,27.94 9.65,31.75 9.65,34.8 5.08,38.1 5.08,58.42 13.21,66.55
  Bottom 0.406: 12.19,20.32 U3.5 | 13.21,66.55 R12.1
N$16  (via drill 0.35)
  Top 0.406: v50.04,37.59 48.26,39.37 48.26,46.23 49.05,47.02 S2.2
  Bottom 0.406: S2.1 S2.2 | D2.A 50.29,37.85 v50.04,37.59
N$17
  Bottom 0.406: D3.A 47.24,22.18 WAVE-TRIGGER.P$1_TIP
N$18  (via drill 0.35)
  Top 0.406: v47.24,75.44 45.97,76.71 45.97,83.57 48.26,85.85 R9.1
  Bottom 0.406: v47.24,75.44 D3.C D2.C 52.64,42.74 R23.2
  Bottom 0.508: 52.66,42.72 R23.2
N$19  (via drill 0.35)
  Top 0.254: v11.43,63.5 4.7,63.5 2.79,61.59 2.79,25.4 5.08,22.86 v6.35,22.86
  Bottom 0.254: 13.84,63.5 v11.43,63.5 | v6.35,22.86 12.19,22.86 U3.6
  Bottom 0.406: R13.1 13.84,63.5
N$20
  Bottom 0.406: GATE-OUT.P$1_TIP 63.04,32.59 R24.2
N$21
  Bottom 0.508: R25.1 76.96,92.71 RATIO.2
N$22
  Bottom 0.254: R15.1 9.53,56.64 7.62,54.61 7.62,37.34 10.29,35.18 10.29,28.96 11.3,28.19 U3.8
N$23  (via drill 0.35)
  Top 0.508: v74.04,103.89 74.04,102.74 72.9,101.6 63.25,101.6 62.23,102.62 v62.23,103.63
  Bottom 0.508: v74.04,103.89 74.8,103.12 R28.1 75.69,103 C16.1 75.56,100.08 R30.2 75.69,96.9 R25.2 | v62.23,103.63 U1.2
N$24  (via drill 0.35)
  Top 0.254: v82.04,48.01 82.04,71.37 77.98,75.44 77.98,83.57 v79.76,85.34
  Bottom 0.406: R30.1 81.03,94.36 81.03,86.11 80.26,85.34 v79.76,85.34 | v82.04,48.01 83.31,46.74 83.31,34.8 80.77,32.26 75.69,32.26 64.77,21.59 RATIO_CV.P$1_TIP
N$25
  Bottom 0.508: R31.1 51.43,94.62 52.83,93.22 FM.2
N$26  (via drill 0.35)
  Top 0.406: v59.69,100.58 61.21,102.11 61.21,104.14 61.47,104.39 64.52,104.39 v65.53,103.38
  Bottom 0.406: R32.1 57.15,102.62 59.18,100.58 v59.69,100.58 | v65.53,103.38 66.55,103.38 67.31,102.62 U1.6
  Bottom 0.508: R31.2 R32.1 R33.2 54.23,104.65 C17.1
N$27  (via drill 0.35)
  Top 0.406: v45.97,44.7 45.97,18.03 46.48,17.53 48.26,17.53 48.77,18.03 48.77,20.82 49.28,21.34 69.6,21.59 70.1,21.08 70.1,18.54 70.87,17.78 v71.63,17.78
  Bottom 0.406: R33.1 49.02,101.09 45.97,101.09 v45.97,44.7 | v71.63,17.78 71.71,17.86 FM_CV.P$1_TIP
N$28
  Bottom 0.508: R34.1 52.83,73.15 FEED.2
N$29
  Bottom 0.508: R37.1 76.96,73.78 DECAY.2
N$30  (via drill 0.35)
  Top 0.406: v67.31,98.55 67.31,99.82 68.07,100.58 74.42,100.58 74.93,100.08 74.93,96.52 72.64,94.23 72.64,88.14 v75.69,85.09
  Bottom 0.406: U1.9 v67.31,98.55 | v75.69,85.09 C19.1
  Bottom 0.508: C19.1 75.69,79.25 R36.1 R37.2
N$31  (via drill 0.35)
  Top 0.406: v60.96,90.93 60.96,89.41 v58.42,86.61
  Bottom 0.406: U1.13 62.23,93.47 60.96,92.46 v60.96,90.93 | v58.42,86.61 54.61,82.8 R35.1
  Bottom 0.508: R34.2 53.72,78.99 C18.1 R35.1
N$46
  Top 0.406: X1.10 L1.1
  Top 0.61: X1.9 L1.1
N$47
  Top 0.61: X1.1 X1.2 L2.1
N$49
  Top 0.61: L1.2 12.05,95.9 10.03,97.92 D10.A
N$50
  Top 0.61: L2.2 11.67,81.52 9.91,79.76 D11.C
OSC_LED
  Bottom 0.406: SV4.2 19.18,55.63 R16.2
OSC_LED_F
  Bottom 0.406: OSC.A 78.49,59.69 77.47,58.67 77.47,57.4 75.95,55.88 SV7.2
RATIO_POT  (via drill 0.35)
  Top 0.254: v1.4,18.54 5.84,18.54 v7.62,16.76 | v22.86,22.86 25.65,25.65 U3.18/A4
  Bottom 0.254: SV3.8 7.87,105.92 1.14,99.19 v1.4,18.54 | v7.62,16.76 13.59,16.76 14.86,18.03 18.03,18.03 v22.86,22.86
RATIO_POT_F  (via drill 0.35)
  Top 0.406: SV5.8 56.39,107.44 57.28,108.08 v78.36,108.08
  Bottom 0.508: C16.2 78.49,103 R28.2
  Bottom 0.61: U1.1 59.63,101.66 56.39,105.16 SV5.8 | v78.36,108.08 R28.2
SAW_LED
  Bottom 0.254: SV4.6 17.66,65.79
  Bottom 0.406: 17.66,65.79 R12.2
SAW_LED_F
  Bottom 0.406: SAW.A 54.61,61.21 56.52,61.21 61.34,66.04 SV7.6
SCLK  (via drill 0.35)
  Top 0.254: v30.23,13.84 29.59,14.48 29.59,15.75 28.57,16.76 25.65,16.76 21.84,20.83 21.84,26.42 21.34,26.92 19.05,26.92 v15.24,30.73
  Bottom 0.254: v15.24,30.73 U3.9
  Bottom 0.406: U4.2 v30.23,13.84
SDATA
  Bottom 0.254: U4.1 29.59,12.57 28.7,11.68 26.54,11.68 26.04,12.19 26.04,14.35 27.18,15.49 U3.22/A8
SIN_LED
  Bottom 0.254: R10.2 19.18,70.87
  Bottom 0.406: 19.18,70.87 SV4.8
SIN_LED_F
  Bottom 0.406: SIN.A 53.59,68.83 57.02,68.83 59.31,71.12 SV7.8
SQ_LED
  Bottom 0.254: R11.2 18.42,68.33 SV4.7
SQ_LED_F
  Bottom 0.406: SQ.A 58.17,68.58 SV7.7
TRI_LED
  Bottom 0.406: SV4.5 R13.2
TRI_LED_F
  Bottom 0.406: TRI.A 61.72,63.5 SV7.5
WAVE_TRIG_F
  Top 0.406: SV6.2 62.99,76.96 60.96,78.99 60.96,82.59 56.63,86.6 56.63,90.28 R18.1
  Top 0.508: T2.3 56.63,86.6
WAVESHAPE  (via drill 0.35)
  Top 0.254: v15.24,40.39 16.51,41.78 16.51,75.69 17.78,76.71 SV2.2
  Bottom 0.254: U3.7 16.26,29.46 16.26,30.99 12.7,34.54 11.68,34.54 10.67,35.56 10.67,39.62 11.43,40.39 v15.24,40.39

### Text on the board
bPlace: Red stripe / here
tNames: + | + | + | + | + | +
bNames: +12V | GND | GND | GND | -12V | Version 2.0 | Version 2.0